# EAGLE design DAM1941_POWER (EAGLE 9.3.1)

## Sheet 1 of 2
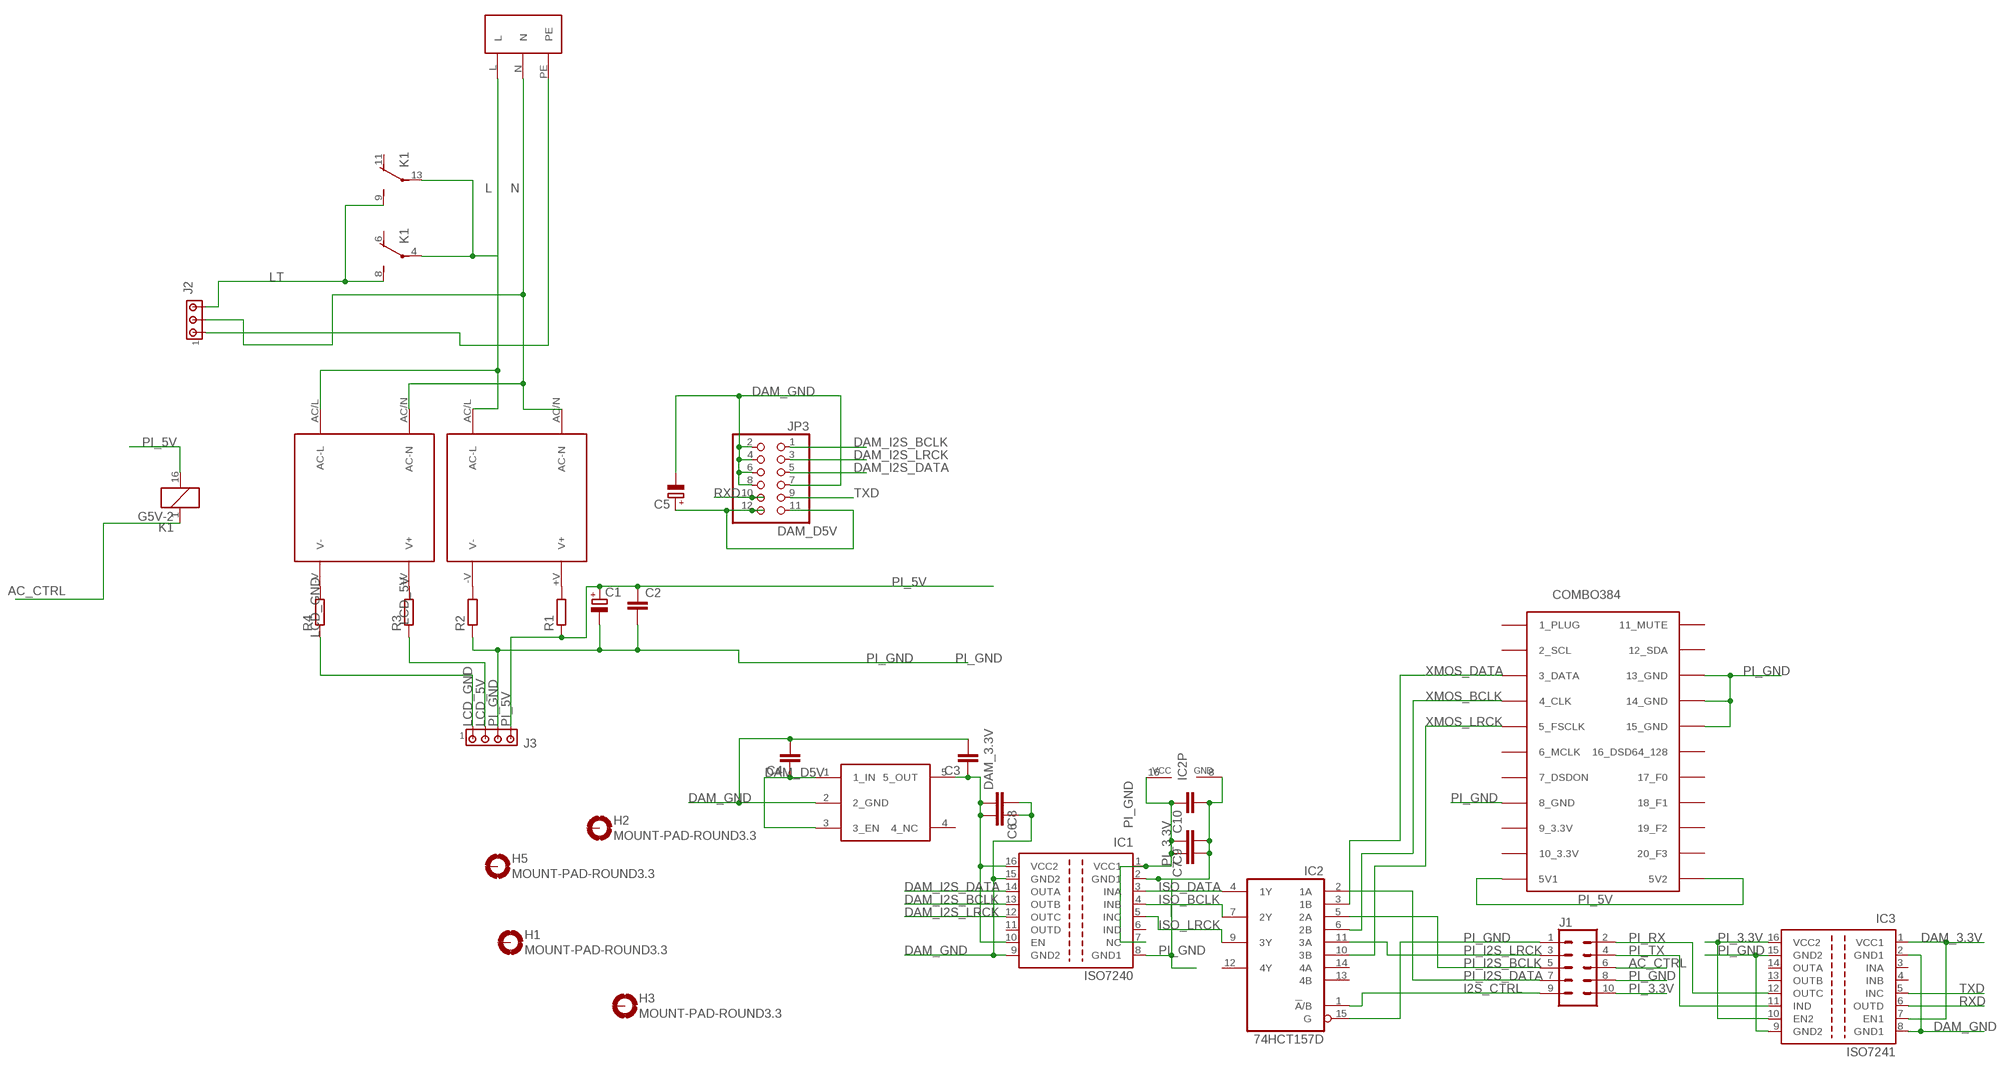
[diagram p0: schematic, sheet 1]

### Parts
C1  CPOL-EUE5-8.5  [E5-8,5]
C2  C-EU050-050X075  [C050-050X075]
C3  C-EUC0805  [C0805]
C4  C-EUC0805  [C0805]
C5  CPOL-EUSP-CAP-CX  [SP-CAP-CX]
C6  C-EUC0805  [C0805]
C7  C-EUC0805  [C0805]
C8  C-EUC0805  [C0805]
C9  C-EUC0805  [C0805]
C10  C-EUC0805  [C0805]
H1  MOUNT-PAD-ROUND3.3  [3,3-PAD]
H2  MOUNT-PAD-ROUND3.3  [3,3-PAD]
H3  MOUNT-PAD-ROUND3.3  [3,3-PAD]
H5  MOUNT-PAD-ROUND3.3  [3,3-PAD]
IC1  ISO7240  [SO-16DW]
IC2  74HCT157D  [SO16]
IC3  ISO7241  [SO-16DW]
J1  CONN_05X2SHD_LOCK  [2X5-SHROUDED_LOCK]
J2  MTA03-156  [1X3MTA]
J3  MTA04-156  [1X4MTA]
JP3  PINHD-2X6  [2X06]
K1  G5V-2  [G5V-2]
R1  R-EU_M1206  [M1206]
R2  R-EU_M1206  [M1206]
R3  R-EU_M1206  [M1206]
R4  R-EU_M1206  [M1206]
U$1  IRM-15-5  [IRM-15]
U$2  LP5907  [SOT-23-5]
U$3  IRM-10  [IRM-10]
U$4  COMBO384+8675  [COMBO384+8675]
U$6  DD21  [DD21.NOCOVER]

### Nets
AC_CTRL: J1.6 K1.1
DAM_3.3V: C3.1 C6.2 C8.2 IC1.10(EN) IC1.16(VCC2) IC3.1(VCC1) IC3.7(EN1) U$2.5(5_OUT)
DAM_D5V: C4.1 C5.+ JP3.11 JP3.12 U$2.1(1_IN) U$2.3(3_EN)
DAM_GND: C3.2 C4.2 C5.- C6.1 C8.1 IC1.9(GND2) IC1.15(GND2) IC3.2(GND1) IC3.8(GND1) JP3.2 JP3.4 JP3.6 JP3.7 JP3.8 U$2.2(2_GND)
DAM_I2S_BCLK: IC1.13(OUTB) JP3.1
DAM_I2S_DATA: IC1.14(OUTA) JP3.5
DAM_I2S_LRCK: IC1.12(OUTC) JP3.3
I2S_CTRL: IC2.1(!A!/B) J1.9
ISO_BCLK: IC1.4(INB) IC2.7(2Y)
ISO_DATA: IC1.3(INA) IC2.4(1Y)
ISO_LRCK: IC1.5(INC) IC2.9(3Y)
L: K1.4(1:P) K1.13(2:P) U$1.AC/L(AC-L) U$3.AC/L(AC-L) U$6.L
LCD_5V: J3.2 R3.1
LCD_GND: J3.1 R4.1
LT: J2.3 K1.8(1:S) K1.9(2:S)
N: J2.2 U$1.AC/N(AC-N) U$3.AC/N(AC-N) U$6.N
N$1: R1.2 U$1.+V(V+)
N$2: J2.1 U$6.PE
N$3: R2.2 U$1.-V(V-)
N$4: R3.2 U$3.+V(V+)
N$5: R4.2 U$3.-V(V-)
PI_3.3V: C7.1 C9.1 C10.1 IC1.1(VCC1) IC1.7(NC) IC2.16(VCC) IC3.10(EN2) IC3.16(VCC2) J1.10
PI_5V: C1.+ C2.1 J3.4 K1.16 R1.1 U$4.5V1 U$4.5V2
PI_GND: C1.- C2.2 C7.2 C9.2 C10.2 IC1.2(GND1) IC1.8(GND1) IC2.8(GND) IC2.15(G) IC3.9(GND2) IC3.15(GND2) J1.1 J1.8 J3.3 R2.1 U$4.8_GND U$4.13_GND U$4.14_GND U$4.15_GND
PI_I2S_BCLK: IC2.5(2A) J1.5
PI_I2S_DATA: IC2.2(1A) J1.7
PI_I2S_LRCK: IC2.11(3A) J1.3
PI_RX: IC3.12(OUTC) J1.2
PI_TX: IC3.11(IND) J1.4
RXD: IC3.6(OUTD) JP3.10
TXD: IC3.5(INC) JP3.9
XMOS_BCLK: IC2.6(2B) U$4.4_CLD/DSDCLK(4_CLK)
XMOS_DATA: IC2.3(1B) U$4.3_DATA/DSD1(3_DATA)
XMOS_LRCK: IC2.10(3B) U$4.5_FSCLK/DSD2(5_FSCLK)
Unconnected: H1.B3,3(MOUNT) H2.B3,3(MOUNT) H3.B3,3(MOUNT) H5.B3,3(MOUNT) IC1.6(IND) IC1.11(OUTD) IC2.12(4Y) IC2.13(4B) IC2.14(4A) IC3.3(INA) IC3.4(INB) IC3.13(OUTB) IC3.14(OUTA) K1.6(1:O) K1.11(2:O) U$2.4(4_NC) U$4.1_PLUG U$4.2_SDA(2_SCL) U$4.6_MCLK U$4.7_DSDON U$4.9_3.3V U$4.10_3.3V U$4.11_MUTE U$4.12_SDA U$4.16_DSD64_128 U$4.17_F0 U$4.18_F1 U$4.19_F2 U$4.20_F3

## Sheet 2 of 2
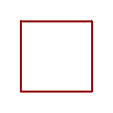
[diagram p1: schematic, sheet 2]

### Parts
PCB2  RPI3-HOLE  [RPI3-HOLE]

## Library data of the parts
C1 C5 = Vwvwbg:CPOL-EU: POLARIZED CAPACITOR, European symbol
C2-C4 C6-C10 = Vwvwbg:C-EU: CAPACITOR, European symbol
H1-H3 H5 = holes:MOUNT-PAD-ROUND: MOUNTING PAD, round
IC1 = texas:ISO7240: HIGH SPEED QUAD DIGITAL ISOLATORS Source: http://focus.ti.com/lit/ds/symlink/iso7240m.pdf; MPN: ISO7240MDW; OC_FARNELL: 1755124; OC_NEWARK: 58M0385
IC2 = 74xx-eu:74*157: Quadruple 2-line to 1-line data SELECTOR/MULTIPLEXER
IC3 = texas:ISO7241: HIGH SPEED QUAD DIGITAL ISOLATORS Source: http://focus.ti.com/lit/ds/symlink/iso7240m.pdf; MPN: ISO7241CDW; OC_FARNELL: 1575372; OC_NEWARK: 73M3155
J1 = SparkFun-Connectors:CONN_05X2: Multi connection point. Often used as Generic Header-pin footprint for 0.1 inch spaced/style header connections For AVR SPI programming port, see special device with nice symbol: "AVR_SPI_PROG_5x2.dev" You can populate with any combo of single row headers, but if you'd like an exact match, check these: 2x5 AVR ICSP Male Header <https://www.sparkfun.com/products/778> (PRT-00778) 2x5 Pin Shrouded Header <https://www.sparkfun.com/products/8506> (PRT-08506) On any of the 0.1 inch spaced packages, you can populate with these: Break Away Headers - Straight <https://www.sparkfun.com/products/116> (PRT-00116) Break Away Male Headers - Right Angle <https://www.sparkfun.com/products/553> (PRT-00553) Female Headers <https://www.sparkfun.com/products/115> (PRT-00115) Break Away Headers - Machine Pin <https://www.sparkfun.com/products/117> (PRT-00117) Break Away Female Headers - Swiss Machine Pin <https://www.sparkfun.com/products/743> (PRT-00743) Special note: the shrouded connector mates well with our 5x2 ribbon cables: 2x5 Pin IDC Ribbon Cable <https://www.sparkfun.com/products/8535> (PRT-08535); PROD_ID: CONN-08671; SF_ID: PRT-08506
J2 = con-amp:MTA03-156: AMP connector
J3 = con-amp:MTA04-156: AMP connector
JP3 = pinhead:PINHD-2X6: PIN HEADER
K1 = relay:G5V-2: OMRON PCB Relay Source: http://www.omron.com/ecb/products/pdf/en-g5v2.pdf; MPN: G5V-2 5DC; OC_FARNELL: 9949488; OC_NEWARK: 78K5703
PCB2 = e14_Rpi3_RevA:RPI3-HOLE: Device for Raspberry Pi 3 board created by Dave Young for www.element14.com More information and support community is available at https://www.element14.com/community/community/raspberry-pi
R1-R4 = Vwvwbg:R-EU_: RESISTOR, European symbol
U$1 = Vwvwbg:IRM-15-5
U$2 = Vwvwbg:LP5907
U$3 = Vwvwbg:IRM-10
U$4 = Vwvwbg:COMBO384+8675
U$6 = Vwvwbg:DD21

## Board
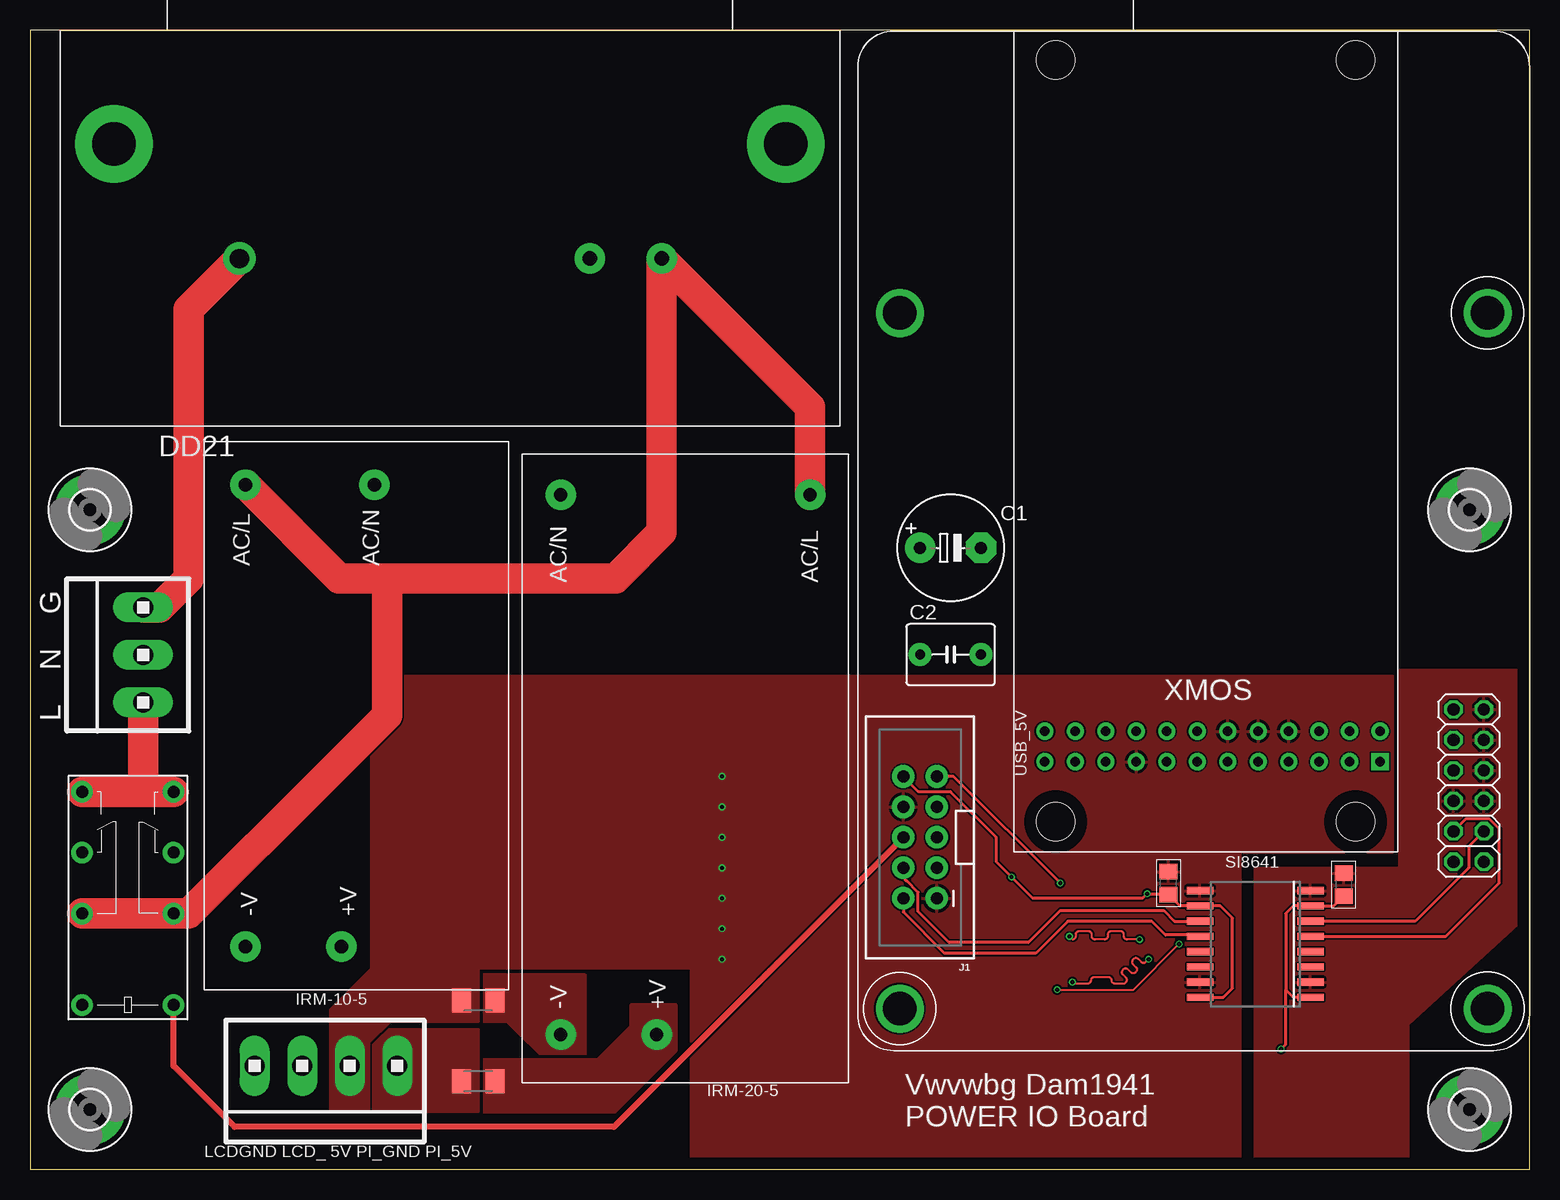
[diagram p2: board, top side]
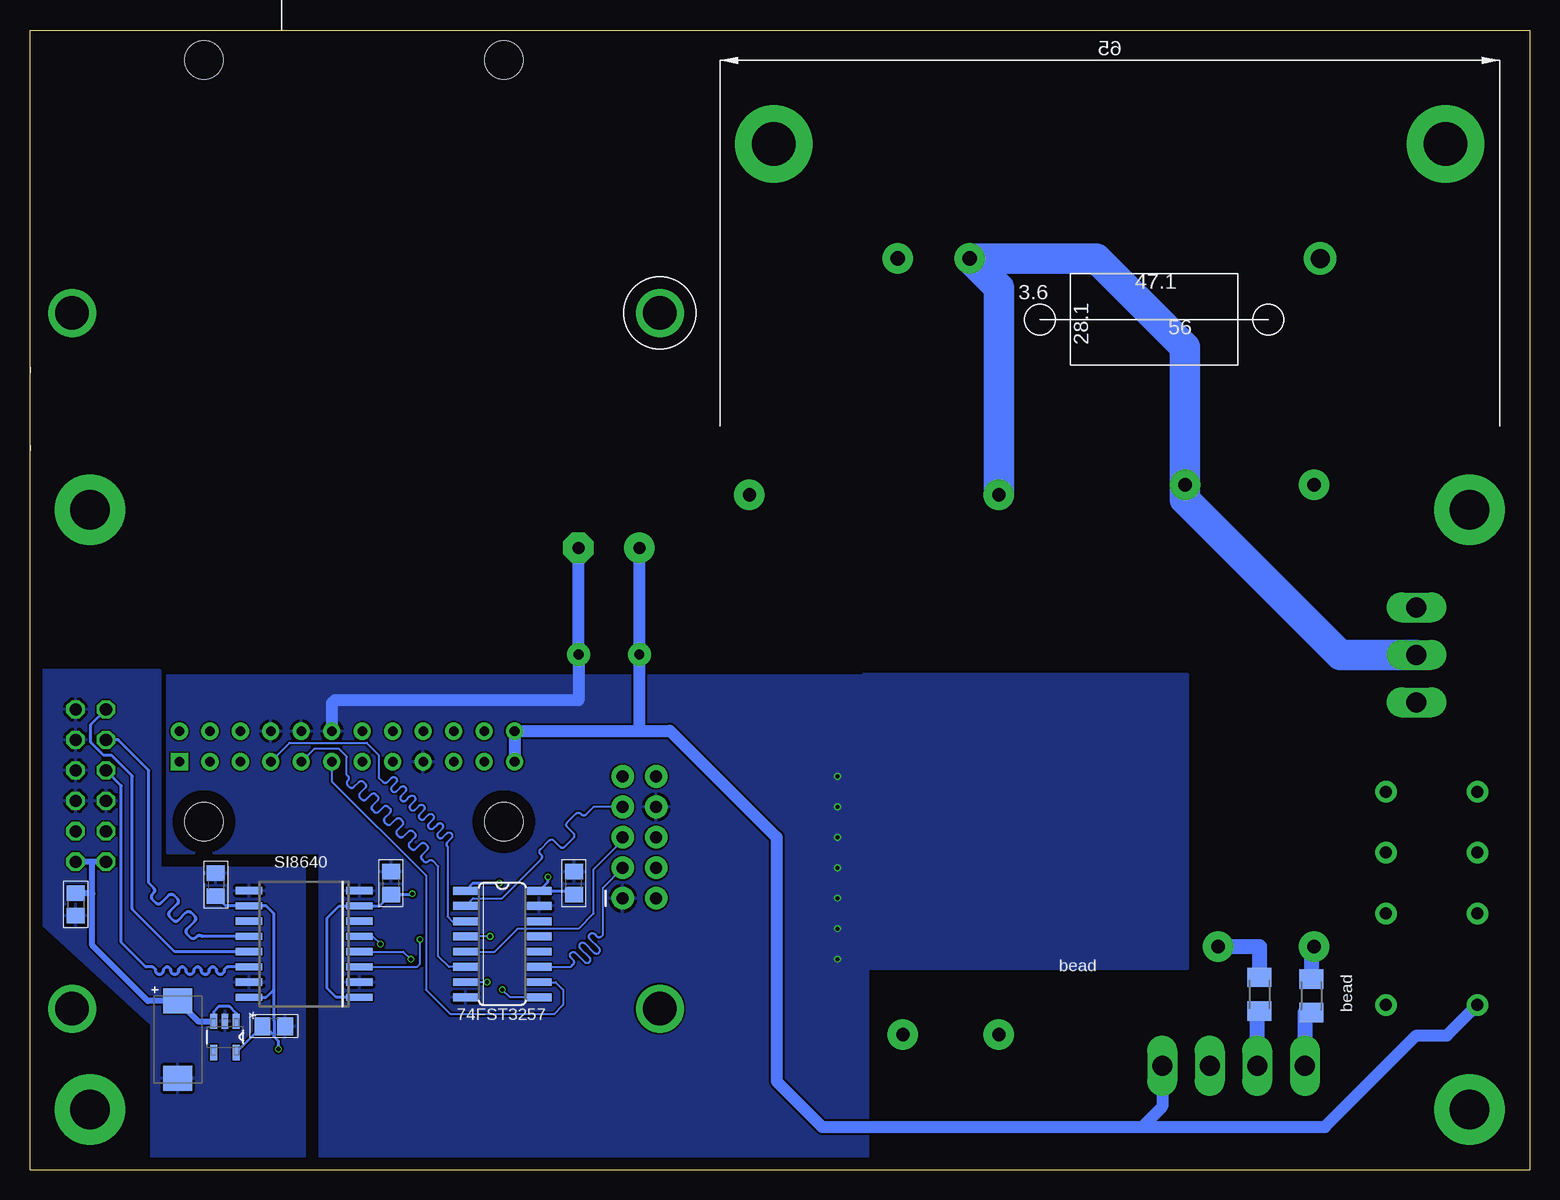
[diagram p3: board, bottom side, seen from below]

Size 125 x 95 mm. Coordinates in mm from the lower left corner, seen from the top.
Outline: 125,95 0,95 0,0 125,0 125,95
Copper layers (1*16): Top 0.035mm / dielectric 1.5mm / Bottom 0.035mm
Design rules "default *": minimum track width 6mil, minimum drill 0.3mm, track to track 6mil, track to pad 6mil, pad to pad 6mil, via to via 6mil, smd to smd 6mil, copper to edge 40mil, drill to drill 6mil, minimum pad ring 10mil, minimum via ring 4mil, stop-mask expansion 4mil, vias tented up to drill 0.36mm, thermal gap 10mil

### Footprints (pad centres in the part's own frame; a part is rotated, then mirrored left to right if it is on the bottom)
E5-8,5 = drill 1.016 pad 2.54: + -2.54,0 | drill 1.016 pad 2.54 octagon: - 2.54,0
C050-050X075 = drill 0.813 pad 1.93: 1 -2.54,0; 2 2.54,0
C0805 = smd 1.3 x 1.5: 1 -0.95,0; 2 0.95,0
SP-CAP-CX = smd 2.062 x 2.4: + -2.754,0; - 3.707,0
3,3-PAD = drill 3.3 pad 5.842: B3,3 0,0
SO-16DW = smd 0.6 x 2.2: 1 -4.445,-4.6; 2 -3.175,-4.6; 3 -1.905,-4.6; 4 -0.635,-4.6; 5 0.635,-4.6; 6 1.905,-4.6; 7 3.175,-4.6; 8 4.445,-4.6; 9 4.445,4.6; 10 3.175,4.6; 11 1.905,4.6; 12 0.635,4.6; 13 -0.635,4.6; 14 -1.905,4.6; 15 -3.175,4.6; 16 -4.445,4.6
SO16 = smd 0.66 x 2.032: 1 -4.445,-3.073; 2 -3.175,-3.073; 3 -1.905,-3.073; 4 -0.635,-3.073; 5 0.635,-3.073; 6 1.905,-3.073; 7 3.175,-3.073; 8 4.445,-3.073; 9 4.445,3.073; 10 3.175,3.073; 11 1.905,3.073; 12 0.635,3.073; 13 -0.635,3.073; 14 -1.905,3.073; 15 -3.175,3.073; 16 -4.445,3.073
2X5-SHROUDED_LOCK = drill 1.016 pad 1.88: 1 -1.397,5.08; 2 1.397,5.08; 3 -1.397,2.54; 4 1.397,2.54; 5 -1.397,0; 6 1.397,0; 7 -1.397,-2.54; 8 1.397,-2.54; 9 -1.397,-5.08; 10 1.397,-5.08
1X3MTA = drill 1.676 long: 1 3.937,0; 2 -0.025,0; 3 -3.988,0
1X4MTA = drill 1.676 long: 1 5.944,0; 2 1.981,0; 3 -1.981,0; 4 -5.944,0
2X06 = drill 1.016 octagon: 1 -6.35,-1.27; 2 -6.35,1.27; 3 -3.81,-1.27; 4 -3.81,1.27; 5 -1.27,-1.27; 6 -1.27,1.27; 7 1.27,-1.27; 8 1.27,1.27; 9 3.81,-1.27; 10 3.81,1.27; 11 6.35,-1.27; 12 6.35,1.27
G5V-2 = drill 1 pad 1.8: 1 -8.89,-3.81; 4 -1.27,-3.81; 6 3.81,-3.81; 8 8.89,-3.81; 9 8.89,3.81; 11 3.81,3.81; 13 -1.27,3.81; 16 -8.89,3.81
RPI3-HOLE = drill 2.8 pad 4: P$1 3.5,3.5; P$2 61.5,3.5; P$3 3.5,52.5; P$4 61.5,52.5
M1206 = smd 1.6 x 2: 1 -1.4,0; 2 1.4,0
IRM-15 = drill 1.1 pad 2.54: +V 4,16; -V 4,24; AC/L 49,3.2; AC/N 49,24
SOT-23-5 = smd 1.27 x 0.559: 1 -1.295,0.94; 2 -1.295,0; 3 -1.295,-0.94; 4 1.295,-0.94; 5 1.295,0.94
IRM-10 = drill 1.1 pad 2.54: +V 3.6,13.95; -V 3.6,21.95; AC/L 42.1,21.95; AC/N 42.1,11.2
COMBO384+8675 = drill 0.8 pad 1.422: 1_PLUG 12,61; 2_SDA 9.46,61; 3_DATA/DSD1 6.92,61; 4_CLD/DSDCLK 4.38,61; 5_FSCLK/DSD2 1.84,61; 5V1 -13.4,61; 5V2 -13.4,58.46; 6_MCLK -0.7,61; 7_DSDON -3.24,61; 8_GND -5.78,61; 9_3.3V -8.32,61; 10_3.3V -10.86,61; 11_MUTE 12,58.46; 12_SDA 9.46,58.46; 13_GND 6.92,58.46; 14_GND 4.38,58.46; 15_GND 1.84,58.46; 16_DSD64_128 -0.7,58.46; 17_F0 -3.24,58.46; 18_F1 -5.78,58.46; 19_F2 -8.32,58.46; 20_F3 -10.86,58.46; GND 14.54,58.46 | drill 0.8 pad 1.422 square: SPDIF_O 14.54,61 | hole 3.2: 12.5,2.5; -12.5,2.5; 12.5,66; -12.5,66
DD21.NOCOVER = drill 1.2 pad 2.54: L -17.65,19.05; N -11.65,19.05 | drill 3.6 pad 6.452: P$1 -28,9.5; P$2 28,9.5 | drill 1.6 pad 2.7: PE 17.55,19.05

### Placement (x,y rotation side)
C1  76.74,51.82 0 top
C2  76.74,42.93 0 top
C3  104.68,11.94 0 bottom
C4  121.19,22.1 270 bottom
C5  112.68,11.31 270 bottom
C6  109.51,23.75 270 top
C7  94.9,23.88 90 top
C8  109.51,23.75 270 bottom
C9  94.9,23.88 90 bottom
C10  79.66,23.88 90 bottom
H1  120,55 0 top
H2  5,55 0 top
H3  120,5 0 top
H5  5,5 0 top
IC1  102.14,18.8 90 bottom
IC2  85.63,18.8 270 bottom
IC3  102.14,18.8 90 top
J1  74.2,27.69 180 top
J2  9.43,42.93 90 top
J3  24.67,8.64 180 top
JP3  119.93,32.01 270 top
K1  8.16,22.61 90 top
PCB2  125,9.91 90 top
R1  37.37,7.37 0 top
R2  37.37,14.1 0 top
R3  22.51,14.61 90 bottom
R4  18.19,14.48 90 bottom
U$1  68.23,7.24 90 top
U$2  108.74,11.05 270 bottom
U$3  39.91,14.99 90 top
U$4  98,95 180 bottom
U$6  35,95 180 top

### Tracks (layer width: path | path; a pad name or v marks a point on that pad's centre or on a via)
AC_CTRL
  Top 0.508: J1.6 48.67,3.56 17.05,3.56 11.97,8.64 K1.1
DAM_3.3V  (via drill 0.35)
  Top 0.254: C6.2 108.68,21.97 IC3.7 105.31,21.97 104.68,21.34 104.68,14.99 | IC3.1 105.31,14.36 104.68,14.99 | v104.3,10.04 104.68,10.42 104.68,14.99
  Bottom 0.254: 104.68,14.99 104.68,21.34 105.31,21.97 IC3.7 108.68,21.97 C6.2 | 104.68,14.99 104.68,12.45 104.66,12.43 104.66,11.18 | 104.66,11.18 104.66,11.08 104.3,10.72 v104.3,10.04 | U$2.5 C3.1 105.42,11.94 104.66,11.18 | IC3.1 105.31,14.36 104.68,14.99
DAM_D5V
  Bottom 0.254: U$2.1 107.8,13.03 108.36,13.59 109.25,13.59 109.68,13.16 U$2.3
  Bottom 0.508: JP3.11 119.79,25.66 | 119.79,25.66 JP3.12 | U$2.3 110.96,12.35 C5.+ 115.18,14.06 119.79,18.67 119.79,22.99 | 119.79,22.99 119.79,25.66 | C4.1 119.85,23.05 119.79,22.99
DAM_GND
  pour Top: 102.14,25.15 114.2,25.15 114.2,41.66 125,41.66 125,21.34 114.84,12.07 114.84,1.02 102.14,1.02
  pour Bottom: 102.14,25.15 102.14,1.02 114.84,1.02 114.84,12.07 125,21.34 125,41.66 114.2,41.66 114.2,25.15
DAM_I2S_BCLK
  Bottom 0.254: IC1.13 112.94,18.17 116.47,21.7 116.47,32.8 118.19,34.52 118.84,34.52 119.92,35.6 119.92,37.1 JP3.1
DAM_I2S_DATA
  Bottom 0.254: IC1.14 108.49,16.89 arc-90 108.81,16.58 arc90 109.12,16.26 | 109.12,16.26 | 109.12,16.26 arc90 109.44,16.58 arc-90 109.76,16.89 109.76,16.89 arc-90 110.08,16.58 arc90 110.39,16.26 | 110.39,16.26 | 110.39,16.26 arc90 110.71,16.58 arc-90 111.03,16.89 | 111.03,16.89 | 111.03,16.89 arc-90 111.35,16.58 arc90 111.66,16.26 111.66,16.26 arc90 111.98,16.58 arc-90 112.3,16.89 | 112.3,16.89 | 112.3,16.89 arc-90 112.62,16.58 arc90 112.93,16.26 | 112.93,16.26 | 112.93,16.26 arc90 113.25,16.58 arc-90 113.57,16.89 113.57,16.89 arc-90 113.89,16.58 arc90 114.2,16.26 | 114.2,16.26 | 114.2,16.26 arc90 114.52,16.58 arc-90 114.84,16.89 115.35,16.89 117.38,18.93 117.38,32 JP3.5
DAM_I2S_LRCK
  Bottom 0.254: IC1.12 110.65,19.44 arc-90 111.1,19.44 111.19,19.35 arc90 111.64,19.35 111.91,19.62 arc90 111.91,20.07 111.28,20.69 arc-90 111.28,21.14 111.56,21.42 arc-90 112,21.42 112.63,20.79 arc90 113.08,20.79 113.35,21.06 arc90 113.35,21.51 112.73,22.14 arc-90 112.73,22.59 113,22.86 arc-90 113.45,22.86 114.08,22.23 arc90 114.52,22.23 114.8,22.51 arc90 114.8,22.95 114.71,23.04 arc-90 114.71,23.49 115.09,23.88 115.09,33.27 117.64,35.82 JP3.3
I2S_CTRL  (via drill 0.35)
  Top 0.254: v85.88,23.88 76.99,32.77 J1.9
  Bottom 0.254: IC2.1 88.07,23.88 v85.88,23.88
ISO_BCLK  (via drill 0.35)
  Top 0.152: v93.25,17.53 93.01,17.29 arc-90 92.64,17.29 92.38,17.55 arc90 92,17.55 91.95,17.5 arc90 91.95,17.12 92.21,16.86 arc-90 92.21,16.49 92.15,16.43 arc-90 91.78,16.43 91.52,16.69 arc90 91.14,16.69 91.09,16.64 arc90 91.09,16.26 91.34,16 arc-90 91.34,15.62 91.22,15.5 90.44,15.5 arc-90 90.17,15.77 arc90 89.9,16.03 88.7,16.03 arc90 88.44,15.77 arc-90 88.17,15.5 87.03,15.5 v86.9,15.62
  Bottom 0.152: IC1.4 93.89,18.17 v93.25,17.53 | v86.9,15.62 IC2.7
ISO_DATA  (via drill 0.35)
  Top 0.152: v92.49,19.18 91.45,19.18 arc-90 91.18,19.45 91.18,19.59 arc90 90.92,19.86 90.11,19.86 arc90 89.84,19.59 89.84,19.45 arc-90 89.58,19.18 88.77,19.18 arc-90 88.51,19.45 88.51,19.59 arc90 88.24,19.86 87.43,19.86 arc90 87.17,19.59 87.17,19.45 arc-90 86.9,19.18 v86.65,19.44
  Bottom 0.152: IC1.3 92.74,16.89 92.49,17.15 v92.49,19.18 | v86.65,19.44 IC2.4
ISO_LRCK  (via drill 0.35)
  Top 0.152: v85.63,14.99 91.98,14.99 v95.79,18.8
  Bottom 0.152: IC2.9 85,14.36 v85.63,14.99 | v95.79,18.8 96.42,19.44 IC1.5
L
  Top 2.54: U$1.AC/L 65.03,63.57 U$6.L 52.65,53.13 48.8,49.28 29.75,49.28 | K1.13 K1.4 13.24,21.34 24.67,32.77 29.75,37.85 29.75,49.28 | U$3.AC/L 25.77,49.28 29.75,49.28
LCD_5V
  Bottom 1.27: J3.2 22.69,13.21 R3.1
LCD_GND
  Bottom 1.27: R4.1 18.73,13.08 J3.1
LT
  Top 2.54: K1.9 9.43,31.5 | 9.43,31.5 K1.8 | J2.3 9.43,31.5
N
  Bottom 2.54: U$1.AC/N 44.23,73.53 U$6.N 36.1,75.95 28.71,68.56 U$3.AC/N 28.71,55.86 15.75,42.91 J2.2
N$1
  pour Top (isolate 0.254, rank 3, no thermals): 37.37,4.83 48.8,4.83 53.88,9.91 53.88,13.72 50.07,13.72 50.07,11.94 47.28,9.15 37.37,9.15
N$2
  Top 2.54: U$6.PE 13.24,71.74 13.24,49.28 10.83,46.87 J2.1
N$3
  pour Top (isolate 0.254, rank 4, no thermals): 37.37,16.26 46.26,16.26 46.26,8.64 43.47,8.64 39.78,12.32 37.37,12.32
N$4
  Bottom 1.27: U$3.+V 22.51,18.59 R3.2
N$5
  Bottom 1.27: U$3.-V 18.19,18.59 R4.2
PI_3.3V  (via drill 0.35)
  Top 0.254: IC3.16 99.47,14.36 100.23,15.12 100.23,20.96 99.22,21.97 IC1.7 95.86,21.97 C7.1 93.18,22.93 v93.12,22.99 92.74,22.61 83.6,22.61 v81.82,24.39 80.55,25.66 80.55,27.69 76.74,31.5 74.07,31.5 J1.10
  Bottom 0.254: IC3.16 99.47,14.36 100.23,15.12 100.23,20.96 99.22,21.97 IC1.7 95.86,21.97 C7.1 93.18,22.93 v93.12,22.99 | C10.1 79.98,23.25 IC2.16 81.82,23.98 v81.82,24.39
PI_5V
  Bottom 1.016: U$4.5V2 84.56,36.58 | 84.56,36.58 74.2,36.58 | 74.2,36.58 C2.1 C1.+ | U$4.5V1 84.56,34.04 84.56,36.58 | 74.2,36.58 71.66,36.58 62.77,27.69 62.77,7.37 58.96,3.56 32.29,3.56 | 32.29,3.56 17.05,3.56 9.43,11.18 6.89,11.18 K1.16 | J3.4 30.61,5.24 32.29,3.56
  pour Top (rank 2, no thermals): 27.21,11.69 37.37,11.69 37.37,4.83 27.21,4.83
PI_GND  (via drill 0.35)
  Bottom 1.016: C1.- C2.2 79.28,39.12 99.6,39.12 99.84,38.88 U$4.15_GND
  other vias: 57.69,32.77 57.69,30.23 57.69,27.69 57.69,25.15 57.69,22.61 57.69,20.07 57.69,17.53
  pour Bottom (rank 2): 55.15,41.15 113.57,41.15 113.57,26.42 100.87,26.42 100.87,1.02 55.15,1.02
  pour Top (rank 2): 55.15,41.15 113.57,41.15 113.57,26.42 100.87,26.42 100.87,1.02 55.15,1.02
  pour Top (isolate 0.254, no thermals): 37.37,17.66 37.37,12.32 30,12.32 28.23,10.55 28.23,4.83 25.05,4.83 25.05,13.34 29.37,17.66
  pour Top (no thermals): 28.48,16.77 28.48,41.15 55.15,41.15 55.15,16.77
  pour Bottom (no thermals): 28.48,41.28 55.53,41.28 55.53,16.77 28.48,16.77
PI_I2S_BCLK
  Bottom 0.152: IC2.5 86.27,18.17 84.36,20.07 79.28,20.07 78.01,21.34 78.01,25.02 75.6,27.44 J1.5
PI_I2S_DATA
  Bottom 0.152: IC2.2 88.07,22.61 85.63,22.61 82.38,25.86 arc-90 82.38,26.24 82.46,26.31 arc90 82.46,26.69 81.72,27.43 arc90 81.34,27.43 80.81,26.9 arc-90 80.43,26.9 79.69,27.64 arc-90 79.69,28.02 80.22,28.55 arc90 80.22,28.93 79.48,29.67 arc90 79.1,29.67 79.02,29.59 arc-90 78.65,29.59 78.01,30.23 J1.7
PI_I2S_LRCK
  Bottom 0.152: IC2.11 79.91,16.89 79.72,17.09 arc-90 79.72,17.47 79.92,17.67 arc90 79.92,18.05 79.9,18.06 arc90 79.52,18.06 78.75,17.29 arc-90 78.37,17.29 78.36,17.3 arc-90 78.36,17.68 79.13,18.45 arc90 79.13,18.83 79.12,18.85 arc90 78.74,18.85 77.96,18.07 arc-90 77.59,18.07 77.57,18.09 arc-90 77.57,18.47 78.34,19.24 arc90 78.34,19.62 78.33,19.63 arc90 77.95,19.63 77.75,19.44 arc-90 77.38,19.44 77.25,19.56 77.25,23.5 J1.3
PI_RX
  Top 0.254: IC3.12 97.41,19.56 94.65,19.56 93.5,20.7 86.52,20.7 83.85,18.04 76.23,18.04 72.8,21.47 J1.2
PI_TX
  Top 0.254: IC3.11 95.41,20.7 94.52,21.59 85.88,21.59 83.22,18.93 76.61,18.93 74.02,21.52 74.02,23.11 73.09,24.04 73.06,24.08 72.8,24.33 J1.4
RXD
  Top 0.254: JP3.10 119.92,26.92 119.92,25.15 115.47,20.7 IC3.6
TXD
  Top 0.254: IC3.5 118.02,19.44 122.46,23.88 122.46,28.41 121.63,29.24 119.7,29.24 JP3.9
XMOS_BCLK
  Bottom 0.152: IC2.6 90.08,16.89 90.96,17.78 90.96,25.28 91.41,25.72 arc-90 91.79,25.72 91.81,25.7 arc90 92.19,25.7 92.32,25.84 arc90 92.32,26.22 91.9,26.64 arc-90 91.9,27.01 92.04,27.15 arc-90 92.42,27.15 92.84,26.73 arc90 93.22,26.73 93.36,26.87 arc90 93.36,27.25 92.94,27.67 arc-90 92.94,28.05 93.07,28.19 arc-90 93.45,28.19 93.87,27.76 arc90 94.25,27.76 94.39,27.9 arc90 94.39,28.28 93.97,28.7 arc-90 93.97,29.08 94.11,29.22 arc-90 94.48,29.22 94.9,28.8 arc90 95.28,28.8 95.42,28.94 arc90 95.42,29.31 95,29.73 arc-90 95,30.11 95.14,30.25 arc-90 95.52,30.25 95.94,29.83 arc90 96.31,29.83 96.45,29.97 arc90 96.45,30.34 96.03,30.77 arc-90 96.03,31.14 96.17,31.28 arc-90 96.55,31.28 96.97,30.86 arc90 97.35,30.86 97.48,31 arc90 97.48,31.38 97.06,31.8 arc-90 97.06,32.17 97.2,32.31 arc-90 97.58,32.31 98,31.89 arc90 98.38,31.89 98.52,32.03 arc90 98.52,32.41 98.5,32.43 arc-90 98.5,32.81 98.58,32.9 98.58,34.42 99.22,35.06 101.32,35.06 U$4.4_CLD/DSDCLK
XMOS_DATA
  Bottom 0.152: IC2.3 89.82,20.7 90.2,21.09 90.2,26.93 arc90 90.2,27.31 89.87,27.64 arc-90 89.87,28.01 89.88,28.02 arc-90 90.25,28.02 90.59,27.69 arc90 90.96,27.69 90.97,27.7 arc90 90.97,28.08 90.64,28.41 arc-90 90.64,28.78 90.65,28.79 arc-90 91.03,28.79 91.36,28.46 arc90 91.73,28.46 91.74,28.47 arc90 91.74,28.84 91.41,29.18 arc-90 91.41,29.55 91.42,29.56 arc-90 91.79,29.56 92.13,29.23 arc90 92.5,29.23 92.51,29.24 arc90 92.51,29.61 92.18,29.95 arc-90 92.18,30.32 92.19,30.33 arc-90 92.56,30.33 92.9,30 arc90 93.27,30 93.28,30.01 arc90 93.28,30.38 92.95,30.72 arc-90 92.95,31.09 92.96,31.1 arc-90 93.33,31.1 93.67,30.77 arc90 94.04,30.77 94.05,30.78 arc90 94.05,31.15 93.72,31.48 arc-90 93.72,31.86 93.73,31.87 arc-90 94.1,31.87 94.44,31.54 arc90 94.81,31.54 94.82,31.55 arc90 94.82,31.92 94.49,32.26 arc-90 94.49,32.63 94.5,32.64 arc-90 94.87,32.64 95.2,32.31 arc90 95.58,32.31 95.92,32.64 95.92,34.55 96.93,35.56 103.36,35.56 U$4.3_DATA/DSD1
XMOS_LRCK
  Bottom 0.152: IC2.10 81.19,15.62 80.55,14.99 80.55,13.72 81.31,12.96 89.95,12.96 91.98,14.99 91.98,24.52 99.84,32.38 U$4.5_FSCLK/DSD2

### Text on the board
tPlace: DD21 | L N G | XMOS | USB_5V | SI8641 | IRM-10-5 | IRM-20-5 | Vwvwbg Dam1941 / POWER IO Board | LCDGND LCD_ 5V PI_GND PI_5V
bPlace: SI8640 | bead | bead | 74FST3257